# EAGLE design hijack-fram_C (EAGLE 6.2)
FRAMjack
REV: C; TITLE: FRAMjack
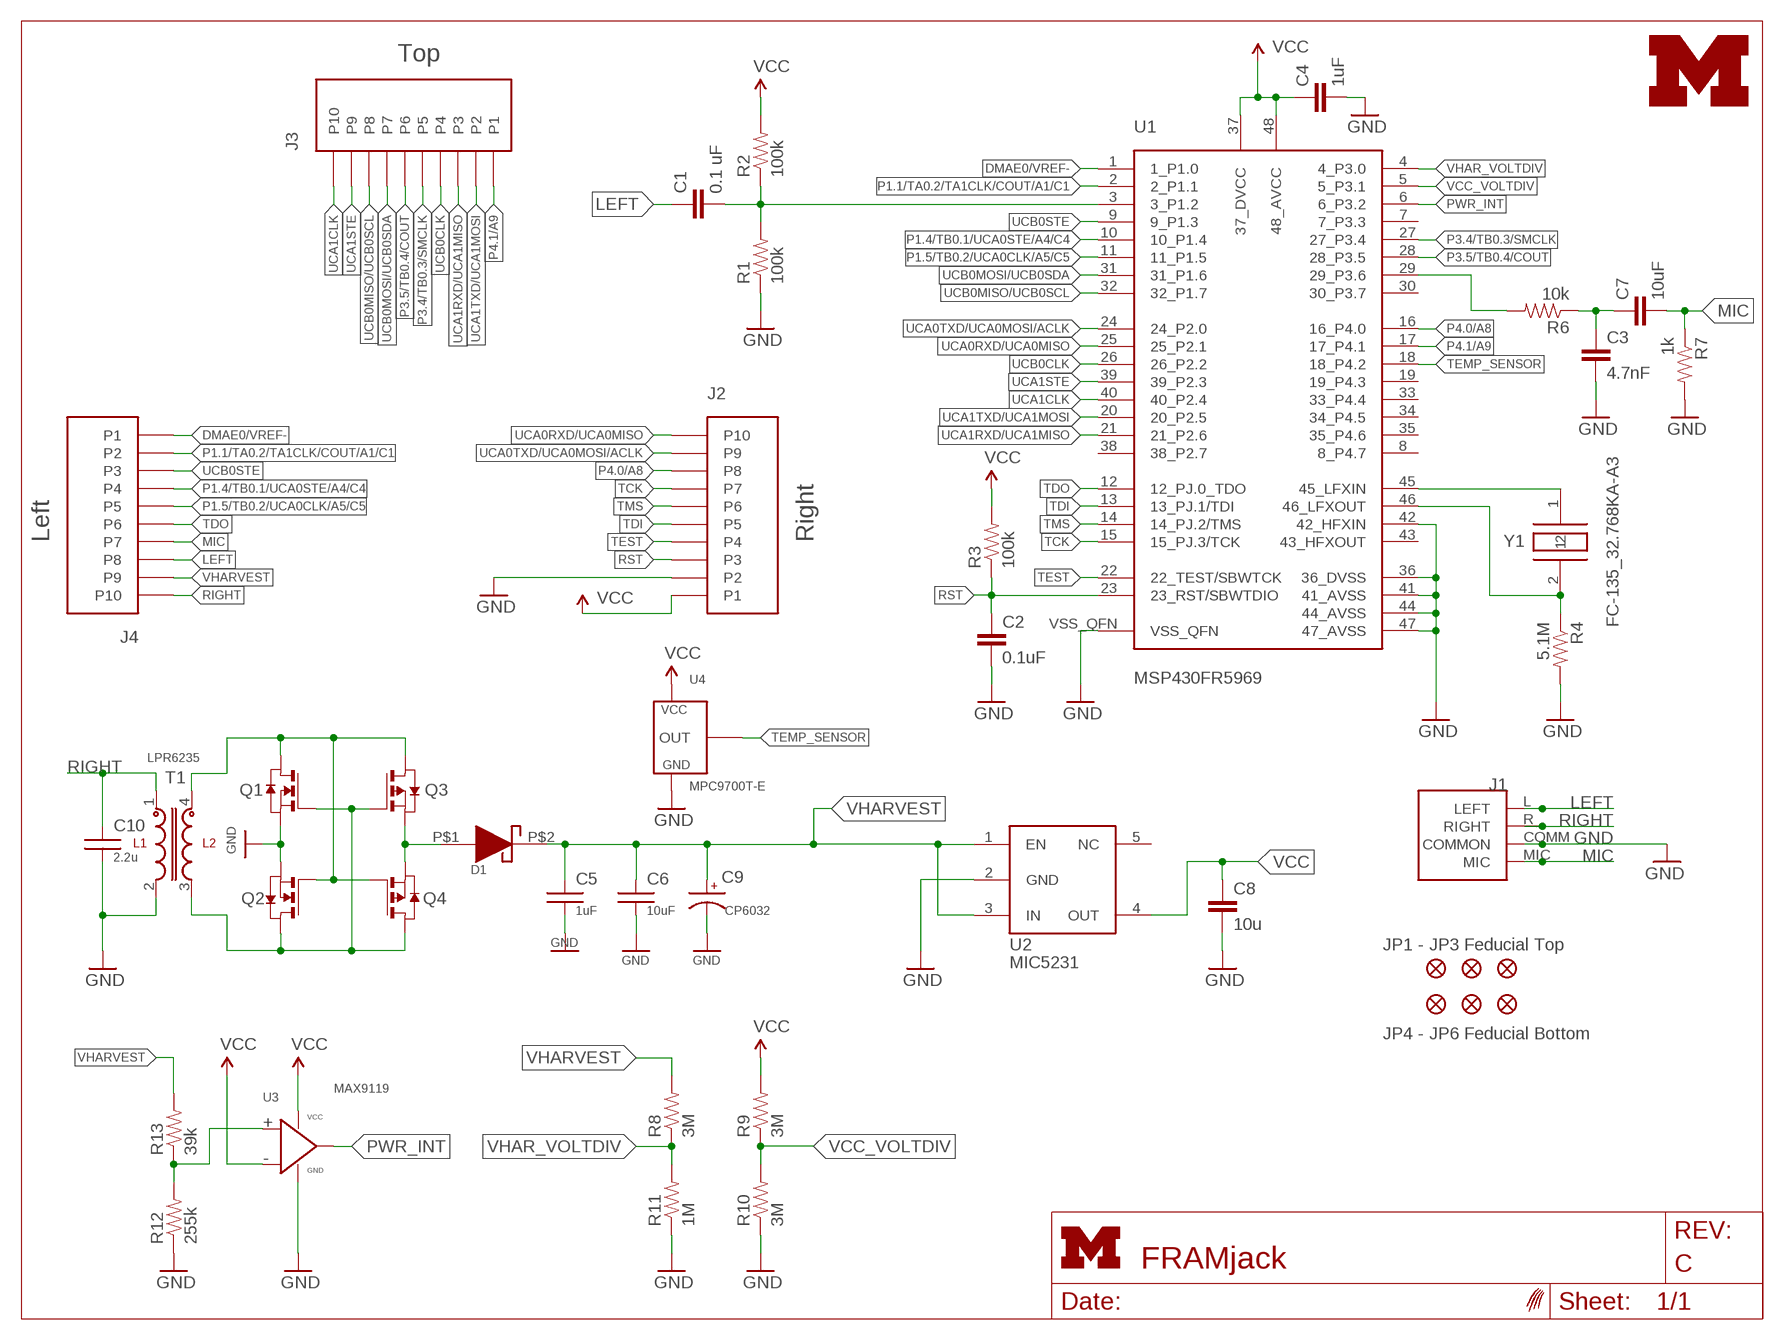
[diagram p0: schematic, sheet 1]

## Parts
C1  0.1 uF  CAP0603-CAP  [0603-CAP]
C2  0.1uF  CAP0603-CAP  [0603-CAP]
C3  4.7nF  CAP0603-CAP  [0603-CAP]
C4  1uF  CAP0603-CAP  [0603-CAP]
C5  1uF  C0603  [C0603]
C6  10uF  C0603  [C0603]
C7  10uF  CAP0603-CAP  [0603-CAP]
C8  10u  C-EUC0603  [C0603]
C9  CP6032  [CT6032]
C10  2.2u  C0603  [C0603]
D1  B5818WS-SCHOTTKY-DIODE  [SOD-323]
J1  3.5JACK4CONNSUNSTONE_QUICKTURN  [PLUGBOARDCONNECTOR_SUNSTONE]
J2  HEADER10POS  [10PIN2MMHEADER]
J3  HEADER10POS  [10PIN2MMHEADER]
J4  HEADER10POS  [10PIN2MMHEADER]
JP1  FIDUCIAL1X2  [FIDUCIAL-1X2]
JP2  FIDUCIAL1X2  [FIDUCIAL-1X2]
JP3  FIDUCIAL1X2  [FIDUCIAL-1X2]
JP4  FIDUCIAL1X2  [FIDUCIAL-1X2]
JP5  FIDUCIAL1X2  [FIDUCIAL-1X2]
JP6  FIDUCIAL1X2  [FIDUCIAL-1X2]
Q1  NMOSSOT23  [SOT-23]
Q2  NMOSSOT23  [SOT-23]
Q3  PMOSSOT23  [SOT-23]
Q4  PMOSSOT23  [SOT-23]
R1  100k  RESISTOR0603-RES  [0603-RES]
R2  100k  RESISTOR0603-RES  [0603-RES]
R3  100k  RESISTOR0603-RES  [0603-RES]
R4  5.1M  RESISTOR0603-RES  [0603-RES]
R6  10k  RESISTOR0603-RES  [0603-RES]
R7  1k  RESISTOR0603-RES  [0603-RES]
R8  3M  RESISTOR0603-RES  [0603-RES]
R9  3M  RESISTOR0603-RES  [0603-RES]
R10  3M  RESISTOR0603-RES  [0603-RES]
R11  1M  RESISTOR0603-RES  [0603-RES]
R12  255k  RESISTOR0603-RES  [0603-RES]
R13  39k  RESISTOR0603-RES  [0603-RES]
T1  LPR6235  [LPR6235]
U1  MSP430FR5969  [RGZ(S-PQFP-N48)]
U2  MIC5231  [SOT23-5]
U3  MAX9119  [SC70-5]
U4  MPC9700T-E  [SOT-23]
U$1  WOLVERINE  [WOLVERINE]
U$4  UMICH_SOLID_SMALL  [UMICH_SOLID_75MIL]
Y1  FC-135_32.768KA-A3  [FC-135]

## Nets
DMAE0/VREF-: J4.P1 U1.1(1_P1.0)
GND: C2.2 C3.2 C4.2 C5.2 C6.2 C8.2 C9.- C10.2 J1.COMM(COMMON) J2.P2 Q1.2(S) Q2.2(S) R1.1 R4.2 R7.2 R10.1 R11.1 R12.1 T1.2 U1.36(36_DVSS) U1.41(41_AVSS) U1.42(42_HFXIN) U1.44(44_AVSS) U1.47(47_AVSS) U1.VSS_QFN U2.2(GND) U3.2(GND) U4.GND
LEFT: C1.1 J1.L(LEFT) J4.P8
MIC: C7.2 J1.MIC J4.P7 R7.1
N$1: C1.2 R1.2 R2.1 U1.3(3_P1.2)
N$2: R4.1 U1.46(46_LFXOUT) Y1.2
N$3: R6.2 U1.29(29_P3.6)
N$6: R12.2 R13.1 U3.3(IN+)
N$7: U1.45(45_LFXIN) Y1.1
N$8: Q1.1(D) Q2.3(G) Q3.1(D) Q4.3(G) T1.4
N$9: Q1.3(G) Q2.1(D) Q3.3(G) Q4.1(D) T1.3
N$12: C3.1 C7.1 R6.1
N$17: D1.P$1(A) Q3.2(S) Q4.2(S)
P1.1/TA0.2/TA1CLK/COUT/A1/C1: J4.P2 U1.2(2_P1.1)
P1.4/TB0.1/UCA0STE/A4/C4: J4.P4 U1.10(10_P1.4)
P1.5/TB0.2/UCA0CLK/A5/C5: J4.P5 U1.11(11_P1.5)
P3.4/TB0.3/SMCLK: J3.P5 U1.27(27_P3.4)
P3.5/TB0.4/COUT: J3.P6 U1.28(28_P3.5)
P4.0/A8: J2.P8 U1.16(16_P4.0)
P4.1/A9: J3.P1 U1.17(17_P4.1)
PWR_INT: U1.6(6_P3.2) U3.1(OUT)
RIGHT: C10.1 J1.R(RIGHT) J4.P10 T1.1
RST: C2.1 J2.P3 R3.1 U1.23(23_RST/SBWTDIO)
TCK: J2.P7 U1.15(15_PJ.3/TCK)
TDI: J2.P5 U1.13(13_PJ.1/TDI)
TDO: J4.P6 U1.12(12_PJ.0_TDO)
TEMP_SENSOR: U1.18(18_P4.2) U4.VOUT(OUT)
TEST: J2.P4 U1.22(22_TEST/SBWTCK)
TMS: J2.P6 U1.14(14_PJ.2/TMS)
UCA0RXD/UCA0MISO: J2.P10 U1.25(25_P2.1)
UCA0TXD/UCA0MOSI/ACLK: J2.P9 U1.24(24_P2.0)
UCA1CLK: J3.P10 U1.40(40_P2.4)
UCA1RXD/UCA1MISO: J3.P3 U1.21(21_P2.6)
UCA1STE: J3.P9 U1.39(39_P2.3)
UCA1TXD/UCA1MOSI: J3.P2 U1.20(20_P2.5)
UCB0CLK: J3.P4 U1.26(26_P2.2)
UCB0MISO/UCB0SCL: J3.P8 U1.32(32_P1.7)
UCB0MOSI/UCB0SDA: J3.P7 U1.31(31_P1.6)
UCB0STE: J4.P3 U1.9(9_P1.3)
VCC: C4.1 C8.1 J2.P1 R2.2 R3.2 R9.2 U1.37(37_DVCC) U1.48(48_AVCC) U2.4(OUT) U3.4(IN-) U3.5(VCC) U4.VDD(VCC)
VCC_VOLTDIV: R9.1 R10.2 U1.5(5_P3.1)
VHAR_VOLTDIV: R8.1 R11.2 U1.4(4_P3.0)
VHARVEST: C5.1 C6.1 C9.+ D1.P$2(C) J4.P9 R8.2 R13.2 U2.1(EN) U2.3(IN)
Unconnected: U1.7(7_P3.3) U1.8(8_P4.7) U1.19(19_P4.3) U1.30(30_P3.7) U1.33(33_P4.4) U1.34(34_P4.5) U1.35(35_P4.6) U1.38(38_P2.7) U1.43(43_HFXOUT) U2.5(NC)

## Notes on the sheet
- Top
- Left | Right
- JP1 - JP3 Feducial Top
- JP4 - JP6 Feducial Bottom

## Library data of the parts
C1-C4 C7 = SparkFun:CAP: Capacitor Standard 0603 ceramic capacitor, and 0.1" leaded capacitor.
C5 C6 C10 = umich:C
C8 = rcl:C-EU: CAPACITOR, European symbol
C9 = umich:CP
D1 = hijack:B5818WS-SCHOTTKY-DIODE
J1 = hijack:3.5JACK4CONN
J2-J4 = hijack:HEADER10POS: Fits 3M 950510-6102-AR
JP1-JP6 = SparkFun:FIDUCIAL: Fiducial Alignment Points Various fiducial points for machine vision alignment.
Q1 Q2 = zetex:NMOSSOT23: MOS FET
Q3 Q4 = zetex:PMOSSOT23: MOS FET
R1-R4 R6-R13 = SparkFun:RESISTOR: Resistor Basic schematic elements and footprints for 0603, 1206, and PTH 1/10th watt (small) resistors.
T1 = umich:LPR6235
U1 = hijack:MSP430FR5969
U2 = berkeley-epic:MIC5231
U3 = hijack:MAX9119
U4 = hijack:MPC9700T-E
U$1 = hijack:WOLVERINE
U$4 = nest_interface:UMICH_SOLID
Y1 = berkeley-epic:FC-135_32.768KA-A3

## Board
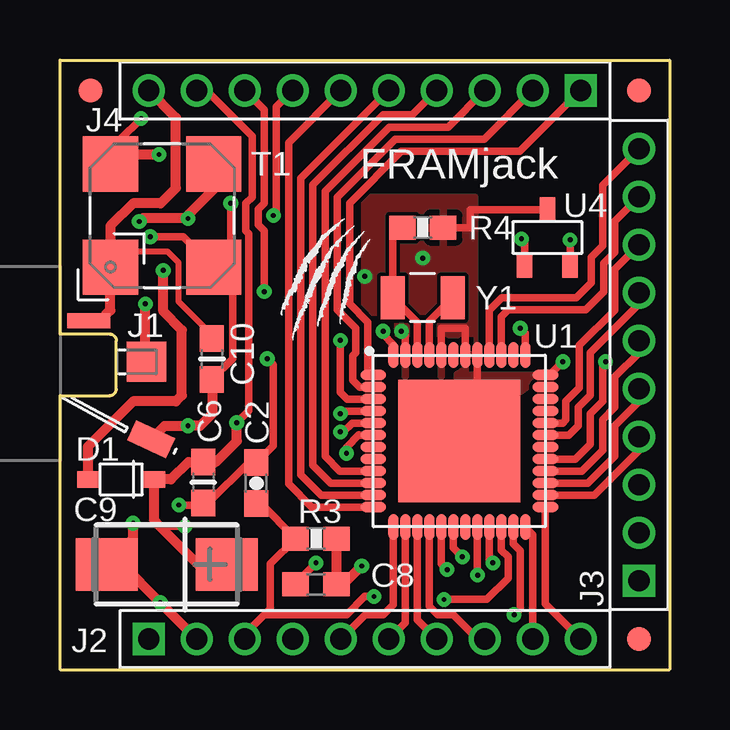
[diagram p1: board, top side]
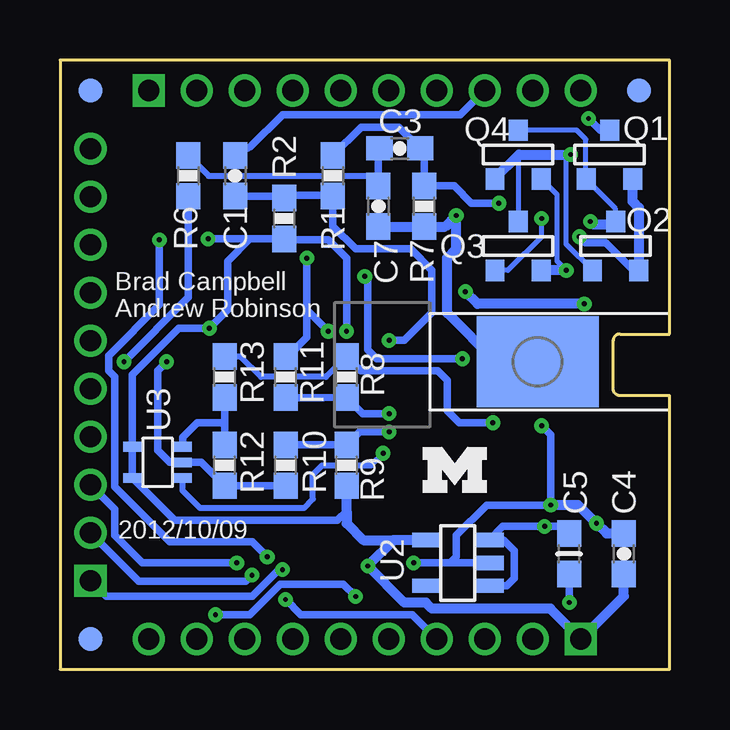
[diagram p2: board, bottom side, seen from below]

Size 25.4 x 25.4 mm. Coordinates in mm from the lower left corner, seen from the top.
Outline: 0,10.87 0,0 25.4,0 25.4,25.4 0,25.4 0,14.47
Copper layers (1*16): Top 0.0178mm / dielectric 59mil / Bottom 0.0178mm
Design rules "default": minimum track width 6mil, minimum drill 14mil, track to track 6mil, track to pad 6mil, pad to pad 6mil, via to via 6mil, smd to smd 6mil, copper to edge 20mil, drill to drill 16mil, minimum pad ring 8mil, minimum via ring 8mil, stop-mask expansion 3mil, vias tented up to drill 10mil, thermal gap 10mil

### Footprints (pad centres in the part's own frame; a part is rotated, then mirrored left to right if it is on the bottom)
0603-CAP = smd 1.1 x 1: 1 -0.85,0; 2 0.85,0
C0603 = smd 1.1 x 1: 1 -0.85,0; 2 0.85,0
CT6032 = smd 2.6 x 2.2: + -2.5,0; - 2.5,0
SOD-323 = smd 0.889 x 0.686: P$1 -1.384,0; P$2 1.384,0
PLUGBOARDCONNECTOR_SUNSTONE = smd 1.778 x 0.914 rotated 155: COMM 3.799,-3.103 | smd 1.651 x 1.651: L 3.601,0.127 | smd 5.08 x 3.81 bottom: MIC 5.501,0.127 | smd 1.778 x 0.635: R 1.201,1.833
10PIN2MMHEADER = drill 0.89 pad 1.346 square: P1 -9,0 | drill 0.89 pad 1.346: P2 -7,0; P3 -5,0; P4 -3,0; P5 -1,0; P6 1,0; P7 3,0; P8 5,0; P9 7,0; P10 9,0
FIDUCIAL-1X2 = smd 1 x 1: 1 0,0
SOT-23 = smd 0.787 x 0.889: 1 0.025,-1.016; 2 -0.94,1.016; 3 0.991,1.016
0603-RES = smd 1.1 x 1: 1 -0.85,0; 2 0.85,0
LPR6235 = smd 2.3 x 2.3: 1 -2.15,2.15; 2 -2.15,-2.15; 3 2.15,-2.15; 4 2.15,2.15
RGZ(S-PQFP-N48) = smd 1.075 x 0.42: 1 -3.587,2.75; 2 -3.587,2.25; 3 -3.587,1.75; 4 -3.587,1.25; 5 -3.587,0.75; 6 -3.587,0.25; 7 -3.587,-0.25; 8 -3.587,-0.75; 9 -3.587,-1.25; 10 -3.587,-1.75; 11 -3.587,-2.25; 12 -3.587,-2.75; 25 3.587,-2.75; 26 3.587,-2.25; 27 3.587,-1.75; 28 3.587,-1.25; 29 3.587,-0.75; 30 3.587,-0.25; 31 3.587,0.25; 32 3.587,0.75; 33 3.587,1.25; 34 3.587,1.75; 35 3.587,2.25; 36 3.587,2.75 | smd 0.42 x 1.075: 13 -2.75,-3.587; 14 -2.25,-3.587; 15 -1.75,-3.587; 16 -1.25,-3.587; 17 -0.75,-3.587; 18 -0.25,-3.587; 19 0.25,-3.587; 20 0.75,-3.587; 21 1.25,-3.587; 22 1.75,-3.587; 23 2.25,-3.587; 24 2.75,-3.587; 37 2.75,3.587; 38 2.25,3.587; 39 1.75,3.587; 40 1.25,3.587; 41 0.75,3.587; 42 0.25,3.587; 43 -0.25,3.587; 44 -0.75,3.587; 45 -1.25,3.587; 46 -1.75,3.587; 47 -2.25,3.587; 48 -2.75,3.587 | smd 5.1 x 5.1: VSS_QFN 0,0
SOT23-5 = smd 0.6 x 1.2: 1 -0.95,-1.306; 2 0,-1.306; 3 0.95,-1.306; 4 0.95,1.306; 5 -0.95,1.306
SC70-5 = smd 0.4 x 0.75: 1 -0.65,-1.05; 2 0,-1.05; 3 0.65,-1.05; 4 0.65,1.05; 5 -0.65,1.05
SOT-23' = smd 0.65 x 1.05: GND 0,1.15; VDD -0.95,-1.15; VOUT 0.95,-1.15
FC-135 = smd 1 x 1.8: 1 -1.25,0; 2 1.25,0

### Placement (x,y rotation side)
C1  18.1,20.58 270 bottom
C2  8.18,7.77 90 top
C3  11.24,21.71 0 bottom
C4  1.91,4.83 90 bottom
C5  4.19,4.83 270 bottom
C6  5.97,7.8 270 top
C7  12.13,19.31 270 bottom
C8  10.67,3.56 180 top
C9  4.45,4.38 180 top
C10  6.33,12.94 270 top
D1  2.55,7.92 0 top
J1  0,12.7 0 top
J2  12.7,1.27 0 top
J3  24.13,12.7 90 top
J4  12.7,24.13 180 top
JP1  24.13,1.27 0 top
JP2  1.27,24.13 0 top
JP3  24.13,24.13 0 top
JP4  1.27,24.13 0 bottom
JP5  24.13,1.27 0 bottom
JP6  24.13,24.13 0 bottom
Q1  2.48,21.46 180 bottom
Q2  2.22,17.65 180 bottom
Q3  6.29,17.65 180 bottom
Q4  6.29,21.46 180 bottom
R1  14.03,20.58 270 bottom
R2  16.06,18.8 270 bottom
R3  10.67,5.46 0 top
R4  15.11,18.41 0 top
R6  20.05,20.57 270 bottom
R7  10.22,19.31 90 bottom
R8  13.46,12.19 90 bottom
R9  13.46,8.51 270 bottom
R10  16,8.51 90 bottom
R11  16,12.19 270 bottom
R12  18.54,8.51 90 bottom
R13  18.54,12.19 90 bottom
T1  4.25,18.92 90 top
U1  16.64,9.53 0 top
U2  8.83,4.44 90 bottom
U3  21.34,8.64 90 bottom
U4  MPC9700T-E  [SOT-23']  20.31,18 0 top
U$1  9.14,13.72 0 top
U$4  10.29,7.37 0 bottom
Y1  15.11,15.49 180 top

### Tracks (layer width: path | path; a pad name or v marks a point on that pad's centre or on a via)
DMAE0/VREF-
  Top 0.305: J4.P1 19.16,21.59 14.22,21.59 12.06,19.43 12.06,15.24 12.83,14.48 12.83,12.5 U1.1
GND  (via drill 0.2)
  Top 0.305: U1.36 20.4,12.28 v20.95,12.83 | v12.7,16.38 12.7,16.51 | v8.64,12.95 8.89,12.7 8.89,9.33 C2.2 7.86,8.62 6.19,6.95 C6.2 5.88,6.86 v4.95,6.86 | U1.47 14.39,13.93 | U1.44 15.89,14.22 16.89,14.22 U1.42 | U1.VSS_QFN 17.39,10.28 U1.41 | 15.88,18.5 R4.2 17.09,18.41 17.09,19.15 U4.GND | v3.76,18.03 5.14,18.03 T1.2 | T1.2 7.24,15.93 7.19,15.89 7.19,12.95 C10.2 6.35,12.06 | v7.11,19.43 7.11,17.48 T1.2 | C8.2 9.82,3.6 v10.67,4.45
  Top 0.406: v3.05,6.1 3.05,5.48 C9.- 2.59,4.38 v4.18,2.79 J2.P2 | 6.38,12.09 6.35,12.06 6.35,10.67 5.84,10.16 v5.33,10.16 4.36,10.16 J1.COMM
  Bottom 0.254: R12.1 18.58,7.66
  Bottom 0.305: v7.11,19.43 8.26,19.43 8.98,20.16 R7.2 10.22,21.55 C3.2 11.28,22.61 12.86,22.61 R1.1 14.04,21.78 | v8.64,12.95 12.19,12.95 12.57,13.34 12.57,16.26 v12.7,16.38 | v14.22,14.1 15.11,14.99 | 15.11,14.99 v15.11,17.14 | 1.21,16.63 Q2.2 1.52,16.63 2.67,17.78 3.5,17.78 v3.76,18.03 | v20.95,12.83 21.34,12.45 21.34,9.14 20.83,8.64 U3.2 19.52,8.64 R12.1 R10.1 | U2.2 9.14,4.44 | 9.14,4.44 v10.66,4.44 v10.67,4.45 | 9.14,4.44 8.89,4.7 8.89,5.59 7.62,6.86 v4.95,6.86 4.95,9.78 v5.33,10.16 | C5.2 4.18,3.96 v4.18,2.79 | R11.1 15.91,13.04 15.11,13.84 15.11,14.99
  Bottom 0.406: Q1.2 1.54,19.5 1.28,19.25 Q2.2 1.28,16.71 | v4.95,6.86 3.81,6.86 v3.05,6.1 2.63,5.68 C4.2
  pour Top: 12.7,19.68 12.7,11.43 17.27,11.43 17.27,19.68
  pour Top (no thermals): 16.51,12.32 20.32,12.32 19.05,11.43 16.51,11.43
LEFT  (via drill 0.2)
  Top 0.305: J4.P8 8.51,23.32 8.51,19.43 8.26,19.18 8.26,18.54 8.51,18.29 v8.51,15.75
  Top 0.406: v3.56,15.24 3.56,12.87 J1.L 3.56,12.78 3.56,12.72
  Bottom 0.305: C1.1 17.46,21.78 16.13,23.11 8.72,23.11 J4.P8
  Bottom 0.406: v3.56,15.24 8,15.24 v8.51,15.75
MIC  (via drill 0.2)
  Top 0.305: J4.P7 9.02,23.45 9.02,19.05 v8.89,18.92
  Bottom 0.406: v8.89,18.92 8.89,17.53 9.27,17.14 9.27,14.86 7.24,12.83 J1.MIC | 8.93,18.96 v8.89,18.92 | C7.2 R7.1 9.36,18.46 v8.89,18.92
N$1  (via drill 0.2)
  Top 0.305: U1.3 11.97,11.28 11.68,11.56 v11.68,13.72
  Bottom 0.305: C1.2 15.86,19.73 R2.1 15.68,19.77 14.08,19.77 R1.2 14.04,18.48 13.08,17.53 10.79,17.53 9.91,16.64 9.91,14.86 11.05,13.72 v11.68,13.72
N$2
  Top 0.305: U1.46 14.89,14.47 Y1.2 13.86,18.02 R4.1
N$3  (via drill 0.2)
  Top 0.305: U1.29 21.48,8.78 22.1,9.4 22.1,10.67 22.61,11.18 22.61,12.7 v22.73,12.83
  Bottom 0.305: R6.2 20.05,15.51 v22.73,12.83
N$6
  Bottom 0.305: 18.6,9.41 R12.2 18.54,10.16 | 18.54,10.16 R13.1 | 18.54,10.16 18.67,10.29 19.68,10.29 20.29,9.69 U3.3
N$7
  Top 0.305: U1.45 15.39,14.52 Y1.1
N$8  (via drill 0.2)
  Top 0.305: 2.49,21.46 2.49,22.08 v3.38,22.96
  Top 0.406: v4.13,21.46 2.49,21.46 T1.4
  Bottom 0.203: 7.3,20.44 Q4.3 | 3.24,16.63 Q2.3 4.32,17.74 4.32,21.27 v4.13,21.46 | Q3.1 6.29,18.67 6.29,21.46
  Bottom 0.305: Q1.1 2.89,22.48 v3.38,22.96
  Bottom 0.406: Q4.3 7.28,20.47 6.29,21.46 v4.13,21.46 | 2.49,22.49 Q1.1
N$9  (via drill 0.2)
  Top 0.406: T1.3 6.4,20.01 5.33,18.94 v5.33,18.8 3.43,18.8 v3.3,18.67
  Bottom 0.203: 3.49,20.44 Q1.3 | 3.49,20.44 2.25,19.2 Q2.1 2.37,18.54 | 3.49,20.44 3.49,22.09 3.87,22.48 Q4.1 | Q3.3 6.73,16.63 5.33,18.03 v5.33,18.8
  Bottom 0.406: 2.37,18.54 3.17,18.54 v3.3,18.67
N$12
  Bottom 0.254: 12.22,20.57 C7.1 12.55,20.57 19.2,20.57 R6.1
  Bottom 0.305: C7.1 12.13,21.67 C3.1
N$17  (via drill 0.2)
  Top 0.406: v4.3,16.63 4.3,14.92 5.08,14.15 5.08,11.43 4.83,11.18 3.05,11.18 1.16,9.29 D1.P$1
  Bottom 0.203: 5.27,20.57 5.35,20.5 Q4.2 4.7,19.8 4.7,17.03 v4.3,16.63
  Bottom 0.406: v4.3,16.63 Q3.2
P1.1/TA0.2/TA1CLK/COUT/A1/C1
  Top 0.305: U1.2 12.48,11.78 12.19,12.06 12.19,13.08 12.32,13.21 12.32,14.22 11.56,14.99 11.56,19.68 13.97,22.1 17.67,22.1 J4.P2
P1.4/TB0.1/UCA0STE/A4/C4
  Top 0.305: U1.10 11.28,7.78 10.54,8.51 10.54,20.19 13.46,23.11 14.68,23.11 J4.P4
P1.5/TB0.2/UCA0CLK/A5/C5
  Top 0.305: U1.11 10.89,7.28 10.03,8.13 10.03,20.46 J4.P5
P3.4/TB0.3/SMCLK
  Top 0.305: J3.P5 24.13,11.18 23.11,10.16 23.11,8.89 22,7.78 U1.27
P3.5/TB0.4/COUT
  Top 0.305: U1.28 21.74,8.28 22.61,9.14 22.61,10.41 23.11,10.92 23.11,12.19 24.13,13.21 J3.P6
P4.0/A8
  Top 0.305: U1.16 15.39,2.65 15.75,2.29 16.38,2.29 17.4,1.27 J2.P8
P4.1/A9  (via drill 0.2)
  Top 0.305: U1.17 15.89,4.41 v16.13,4.17
  Bottom 0.305: 23.83,3.4 J3.P1 23.48,3.05 17.4,3.05 16.28,4.17 v16.13,4.17
PWR_INT  (via drill 0.2)
  Top 0.305: 11.94,9.14 v11.94,9.02 11.94,9.27 12.45,9.78 U1.6
  Bottom 0.254: v11.94,9.02 12.45,8.51 14.48,8.51 14.86,8.13 14.86,7.11 15.24,6.73 19.56,6.73 20.29,7.46 U3.1
RIGHT
  Top 0.254: C10.1 6.33,13.94 4.93,15.34 4.93,16.97 4.47,17.42 2.21,17.42 2.2,17.44
  Top 0.406: T1.1 2.1,17.34 2.2,17.44 | T1.1 2.1,14.97 1.67,14.53 J1.R | J4.P10 4.83,23 4.83,20.07 4.19,19.43 3.05,19.43 2.1,18.49 T1.1
RST  (via drill 0.2)
  Top 0.305: v18.92,2.29 19.18,2.54 19.18,4.95 18.89,5.24 U1.23 | 8.51,2.29 11.94,2.29 12.7,3.05 v13.08,3.05 | C2.1 8.36,6.92 R3.1 8.76,4.41 8.76,2.54 8.51,2.29 | 8.51,2.29 7.7,1.48 J2.P3
  Bottom 0.305: v18.92,2.29 17.5,2.29 16.23,3.56 13.59,3.56 v13.08,3.05
TCK
  Top 0.305: U1.15 14.89,2.08 J2.P7
TDI
  Top 0.305: U1.13 13.89,2.71 13.46,2.29 12.72,2.29 J2.P5
TDO
  Top 0.305: 11.43,23.86 J4.P6 9.53,21.95 9.53,7.75 10.5,6.78 U1.12
TEMP_SENSOR  (via drill 0.2)
  Top 0.305: U1.18 16.39,5.08 v16.76,4.7 | U4.VOUT v21.26,17.91
  Bottom 0.305: v16.76,4.7 17.4,5.33 20.83,5.33 23.11,7.62 23.11,12.19 23.37,12.45 23.37,13.08 21.26,15.19 v21.26,17.91
TEST  (via drill 0.2)
  Top 0.305: U1.22 18.39,4.98 18.67,4.7 18.67,3.81 17.78,2.92 v16,2.92
  Bottom 0.305: J2.P4 10.72,2.29 15.37,2.29 v16,2.92
TMS
  Top 0.305: U1.14 14.39,1.96 J2.P6
UCA0RXD/UCA0MISO
  Top 0.305: J2.P10 20.22,2.75 U1.25
UCA0TXD/UCA0MOSI/ACLK
  Top 0.305: J2.P9 19.7,5.62 U1.24
UCA1CLK
  Top 0.305: J3.P10 22.61,20.18 22.61,17.65 22.14,17.18 22.14,16.12 21.51,15.49 20.45,15.49 20.31,15.49 18.41,15.49 17.89,14.97 U1.40
UCA1RXD/UCA1MISO  (via drill 0.2)
  Top 0.305: U1.21 17.89,4.59 v18.03,4.45
  Bottom 0.305: J3.P3 23.11,6.68 23.11,5.59 21.97,4.45 v18.03,4.45
UCA1STE
  Top 0.305: J3.P9 23.11,18.68 23.11,17.4 22.65,16.93 22.65,15.73 21.9,14.99 18.67,14.99 18.39,14.7 U1.39
UCA1TXD/UCA1MOSI  (via drill 0.2)
  Top 0.305: U1.20 17.39,3.95 v17.4,3.94
  Bottom 0.305: J3.P2 22.11,3.68 17.65,3.68 v17.4,3.94
UCB0CLK
  Top 0.305: J3.P4 24.13,9.14 22.26,7.28 U1.26
UCB0MISO/UCB0SCL
  Top 0.305: U1.32 20.94,10.28 21.08,10.41 21.08,11.18 21.64,11.73 21.64,13.51 23.11,14.98 23.11,16.68 J3.P8
UCB0MOSI/UCB0SDA
  Top 0.305: U1.31 21.2,9.78 21.59,10.16 21.59,10.92 22.1,11.43 22.1,12.95 22.1,13.05 22.1,13.21 24.13,15.24 J3.P7
UCB0STE
  Top 0.305: U1.9 11.66,8.28 11.05,8.89 11.05,19.94 13.72,22.61 16.18,22.61 J4.P3
VCC  (via drill 0.2)
  Top 0.305: U1.48 13.89,13.54 13.46,13.97 v13.46,14.1 | U1.37 19.39,14.01 v19.18,14.22 | U4.VDD 19.36,17.82 v19.23,17.95
  Top 0.406: R3.2 C8.1 11.81,3.56 v12.57,4.32
  Bottom 0.305: 17.49,17.95 18.41,17.02 18.41,14.99 v19.18,14.22 20.45,14.22 22.39,12.29 U3.4 U3.5 20.62,6.22 13.84,6.22 13.46,6.6 | 17.49,17.95 R2.2 16.02,17.91 14.22,17.91 13.46,17.14 v13.46,14.1 | v19.23,17.95 17.49,17.95
  Bottom 0.406: C4.1 1.91,3.06 J2.P1 4.97,2.54 9.91,2.54 10.16,2.79 11.05,2.79 v12.57,4.32 11.5,5.39 | U2.4 11.5,5.39 | 11.5,5.39 12.76,5.39 13.46,6.1 13.46,6.6 R9.2
VCC_VOLTDIV  (via drill 0.2)
  Top 0.305: U1.5 12.18,10.28 11.81,9.91 v11.68,9.91
  Bottom 0.305: v11.68,9.91 12.91,9.91 R9.1 R10.2
VHAR_VOLTDIV  (via drill 0.2)
  Top 0.305: U1.4 11.79,10.78 v11.68,10.67
  Bottom 0.305: v11.68,10.67 12.79,10.67 R8.1 14.42,11.33 15.99,11.33 R11.2
VHARVEST  (via drill 0.2)
  Top 0.305: J4.P9 6.1,24.13 8,22.23 8,19.68 7.75,19.43 7.75,18.29 7.87,18.16 7.87,10.79 v7.37,10.29 | v5.21,5.97 4.15,5.97 4.04,6.08
  Top 0.406: v7.37,10.29 7.37,9.53 6.49,8.65 C6.1 5.35,8.65 4.62,7.92 D1.P$2 3.93,6.19 4.04,6.08 5.74,4.38 C9.+
  Bottom 0.254: R13.2 17.87,13.04 17.02,12.19 14.31,12.19 R8.2
  Bottom 0.305: U2.1 6.79,3.49 6.48,3.81 6.48,4.95 6.92,5.39 U2.3 6.94,5.97 v5.21,5.97 4.48,5.97 C5.1 | v7.37,10.29 8.76,10.29 9.27,10.79 9.27,12.06 9.65,12.45 12.87,12.45 R8.2

### Text on the board
tPlace: FRAMjack
bPlace: Brad Campbell | Andrew Robinson | 2012/10/09